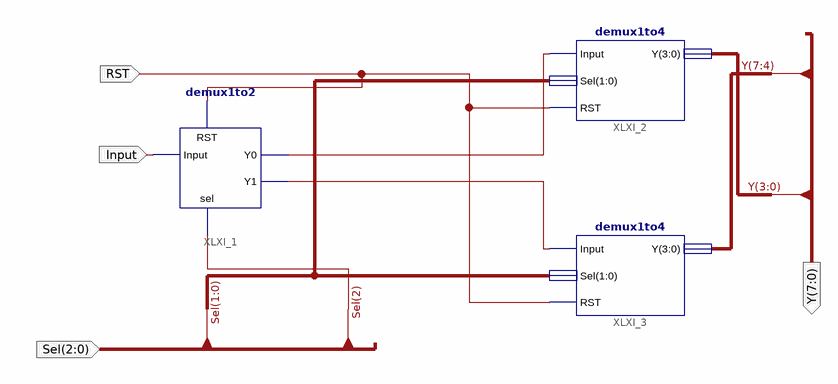
[diagram p0: schematic sheet 1]
// Xilinx ISE schematic demux1to8.sch (artix7) as structural Verilog: 3 symbols, 4 ports
module demux1to8 (
  input  RST,
  input  Input,
  input  [2:0] Sel,
  output [7:0] Y
);

  wire XLXN_3, XLXN_5;

  demux1to2 XLXI_1 (.Input(Input), .RST(RST), .sel(Sel[2]), .Y0(XLXN_3), .Y1(XLXN_5));
  demux1to4 XLXI_2 (.RST(RST), .Input(XLXN_3), .Sel(Sel[1:0]), .Y(Y[3:0]));
  demux1to4 XLXI_3 (.RST(RST), .Input(XLXN_5), .Sel(Sel[1:0]), .Y(Y[7:4]));
endmodule
